# EAGLE design bmcontroller1 (EAGLE 9.3.1)
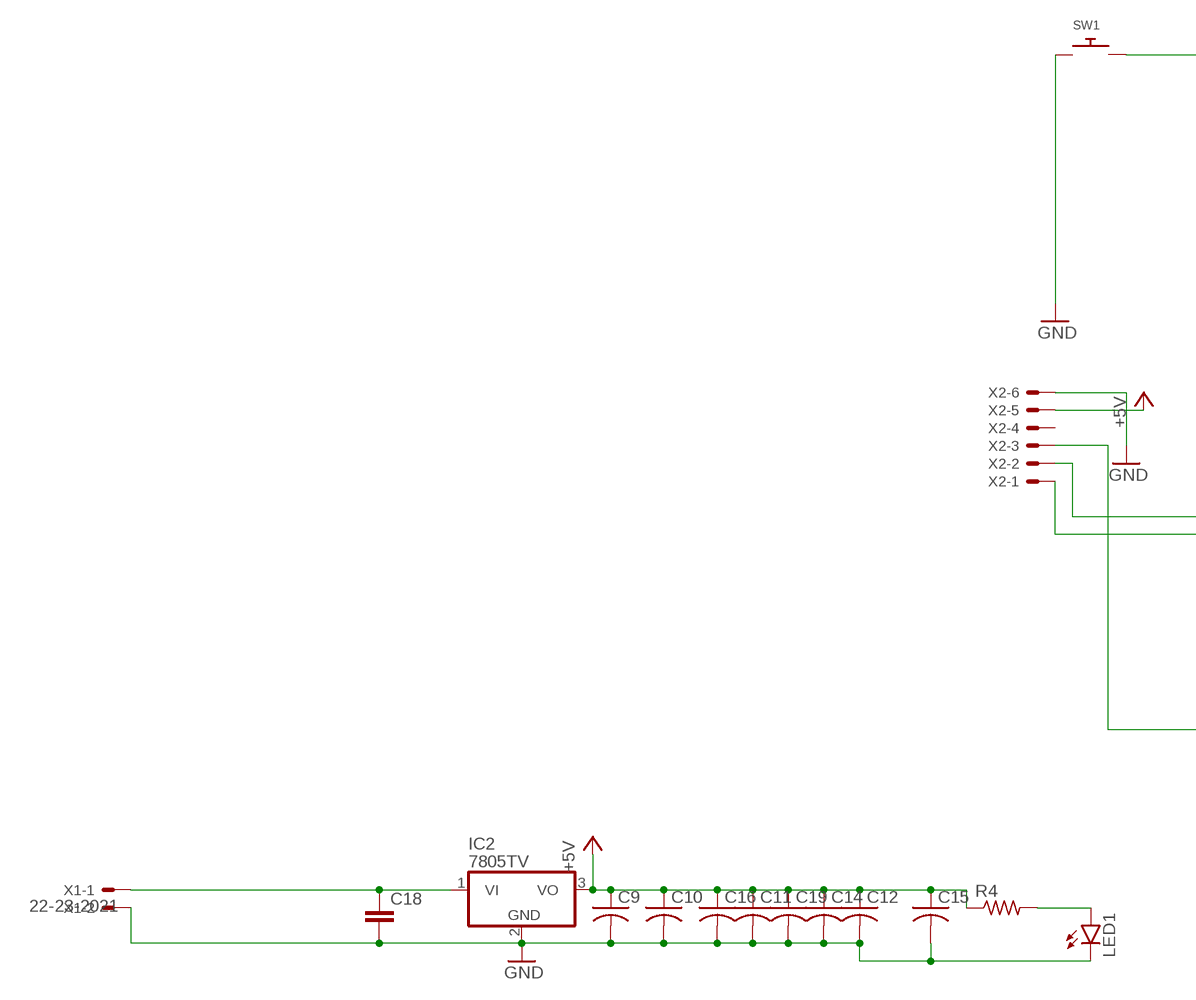
[diagram p0: schematic, sheet 1, part 1 of 2]
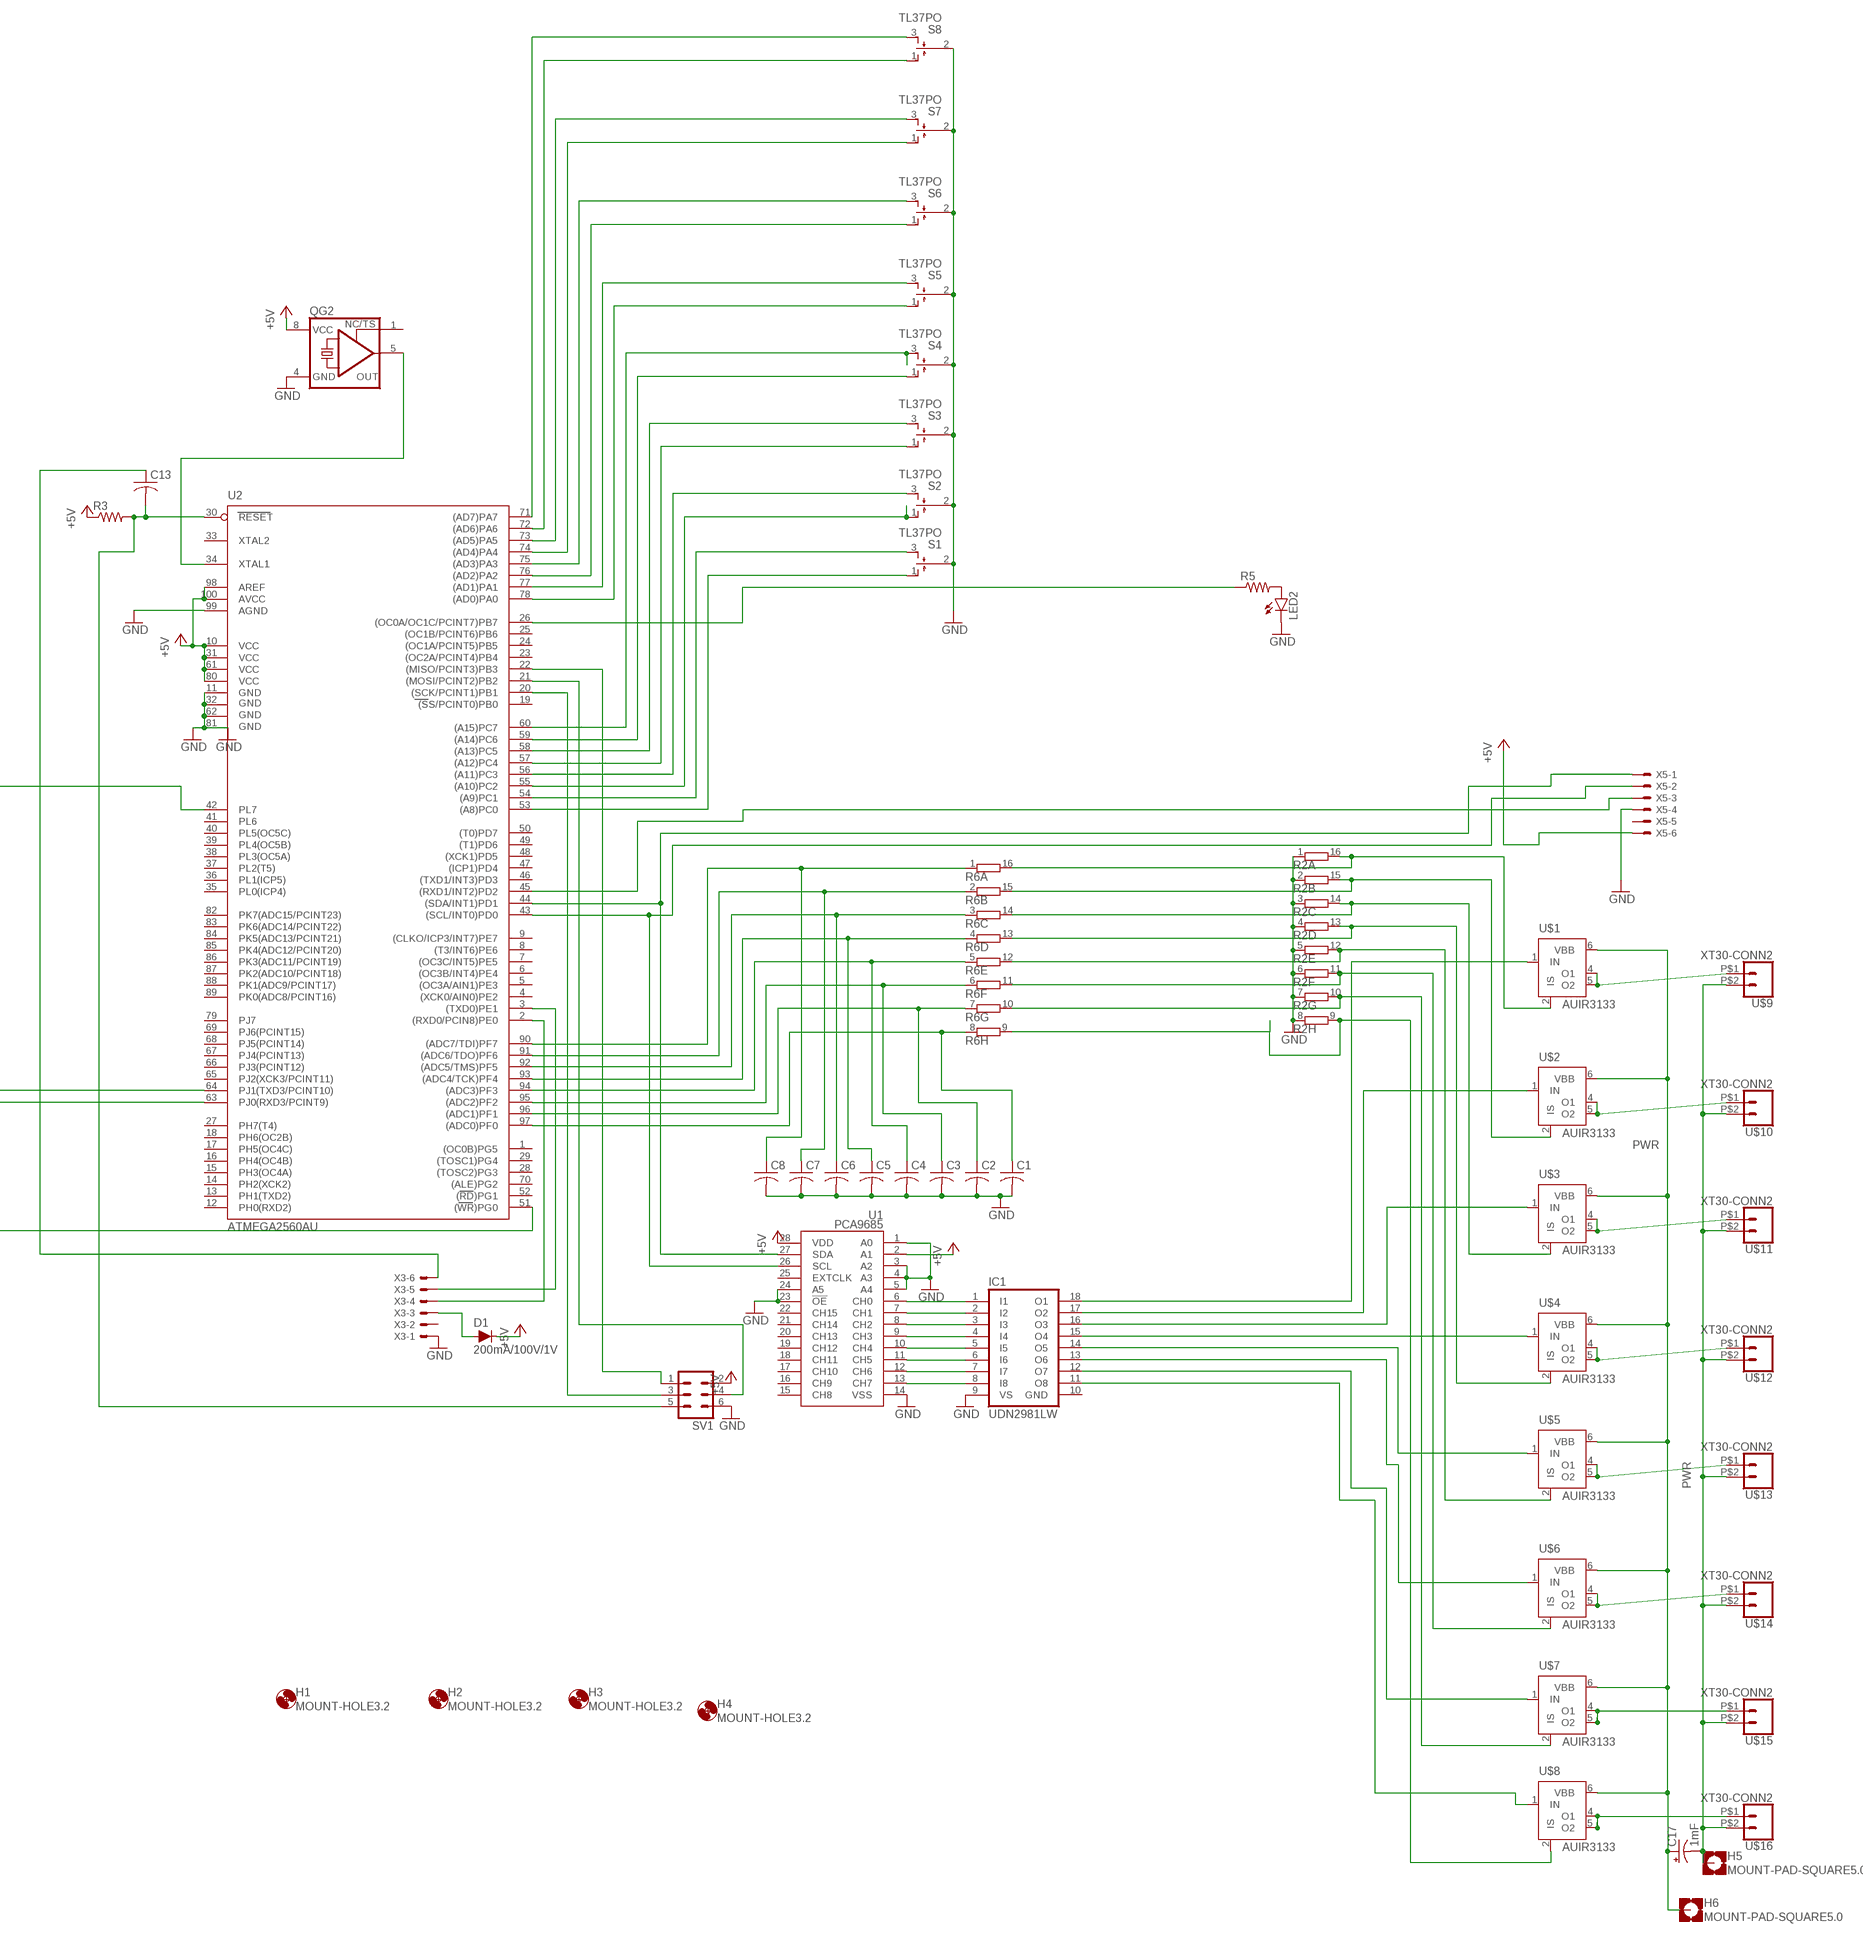
[diagram p1: schematic, sheet 1, part 2 of 2]

## Parts
C1  C-USC0805  [C0805]
C2  C-USC0805  [C0805]
C3  C-USC0805  [C0805]
C4  C-USC0805  [C0805]
C5  C-USC0805  [C0805]
C6  C-USC0805  [C0805]
C7  C-USC0805  [C0805]
C8  C-USC0805  [C0805]
C9  C-USC0805  [C0805]
C10  C-US025-024X044  [C025-024X044]
C11  C-US025-024X044  [C025-024X044]
C12  C-US025-024X044  [C025-024X044]
C13  C-US025-024X044  [C025-024X044]
C14  C-US025-024X044  [C025-024X044]
C15  C-US025-024X044  [C025-024X044]
C16  C-US025-024X044  [C025-024X044]
C17  1mF  1000UF-RADIAL-5MM-25V-20%  [CPOL-RADIAL-5MM-10MM]
C18  C2,5-3  [C2.5-3]
C19  C-USC0805  [C0805]
D1  200mA/100V/1V  DIODE-1N4148  [DIODE-1N4148]
H1  MOUNT-HOLE3.2  [3,2]
H2  MOUNT-HOLE3.2  [3,2]
H3  MOUNT-HOLE3.2  [3,2]
H4  MOUNT-HOLE3.2  [3,2]
H5  MOUNT-PAD-SQUARE5.0  [5,0-PAD-SQUARE]
H6  MOUNT-PAD-SQUARE5.0  [5,0-PAD-SQUARE]
IC1  UDN2981LW  [SO18W]
IC2  7805TV  [TO220V]
LED1  LED3MM  [LED3MM]
LED2  LED3MM  [LED3MM]
QG2  XO-8  [DIL08S]
R2  4816P-T01E  [4816P]
R3  R-US_R0805  [R0805]
R4  R-US_R0805  [R0805]
R5  R-US_R0805  [R0805]
R6  4816P-T01E  [4816P]
S1  TL37PO  [TL3XPO]
S2  TL37PO  [TL3XPO]
S3  TL37PO  [TL3XPO]
S4  TL37PO  [TL3XPO]
S5  TL37PO  [TL3XPO]
S6  TL37PO  [TL3XPO]
S7  TL37PO  [TL3XPO]
S8  TL37PO  [TL3XPO]
SV1  MA03-2  [MA03-2]
SW1  SWITCH_PUSHBUTTONEVQ-PE  [TACT_PANA-EVQ]
U1  PCA9685  [TSSOP-28_4MM]
U2  ATMEGA2560AU  [TQFP100]
U$1  AUIR3133  [TO263-51]
U$2  AUIR3133  [TO263-51]
U$3  AUIR3133  [TO263-51]
U$4  AUIR3133  [TO263-51]
U$5  AUIR3133  [TO263-51]
U$6  AUIR3133  [TO263-51]
U$7  AUIR3133  [TO263-51]
U$8  AUIR3133  [TO263-51]
U$9  XT30-CONN2  [XT30-2]
U$10  XT30-CONN2  [XT30-2]
U$11  XT30-CONN2  [XT30-2]
U$12  XT30-CONN2  [XT30-2]
U$13  XT30-CONN2  [XT30-2]
U$14  XT30-CONN2  [XT30-2]
U$15  XT30-CONN2  [XT30-2]
U$16  XT30-CONN2  [XT30-2]
X1  22-23-2021  [22-23-2021]
X2  22-23-2061  [22-23-2061]
X3  22-23-2061  [22-23-2061]
X5  22-23-2061  [22-23-2061]

## Nets
+5V [power]: C9.1 C10.1 C11.1 C12.1 C14.1 C15.1 C16.1 C19.1 D1.C IC2.3(VO) QG2.8(VCC) R3.1 R4.1 SV1.2 U1.2(A1) U1.28(VDD) U2.10(VCC) U2.31(VCC1) U2.61(VCC2) U2.80(VCC3) U2.98(AREF) U2.100(AVCC) X2.5 X5.6
BIGGND [vhp]: C17.- H5.B5(MOUNT) U$9.P$2 U$10.P$2 U$11.P$2 U$12.P$2 U$13.P$2 U$14.P$2 U$15.P$2 U$16.P$2
GND [power]: C1.2 C2.2 C3.2 C4.2 C5.2 C6.2 C7.2 C8.2 C9.2 C10.2 C11.2 C12.2 C14.2 C15.2 C16.2 C18.2 C19.2 IC1.9(VS) IC2.2(GND) LED1.K(C) LED2.K(C) QG2.4(GND) R2.1 R2.2 R2.3 R2.4 R2.5 R2.6 R2.7 R2.8 S1.2(P) S2.2(P) S3.2(P) S4.2(P) S5.2(P) S6.2(P) S7.2(P) S8.2(P) SV1.6 SW1.P$1 U1.1(A0) U1.3(A2) U1.4(A3) U1.5(A4) U1.14(VSS) U1.23(!OE) U1.24(A5) U2.11(GND) U2.32(GND1) U2.62(GND2) U2.81(GND3) U2.99(AGND) X1.2 X2.6 X3.1 X5.4
N$1: C8.1 R6.1 U2.90((ADC7/TDI)PF7)
N$2: C7.1 R6.2 U2.91((ADC6/TDO)PF6)
N$3: C6.1 R6.3 U2.92((ADC5/TMS)PF5)
N$4: C5.1 R6.4 U2.93((ADC4/TCK)PF4)
N$5: C4.1 R6.5 U2.94((ADC3)PF3)
N$6: C3.1 R6.6 U2.95((ADC2)PF2)
N$7: C2.1 R6.7 U2.96((ADC1)PF1)
N$8: C1.1 R6.8 U2.97((ADC0)PF0)
N$9: S8.1(O) U2.72((AD6)PA6)
N$10: IC1.18(O1) U$1.1(IN)
N$11: IC1.14(O5) U$5.1(IN)
N$12: IC1.1(I1) U1.6(CH0)
N$13: R2.13 R6.13 U$4.2(IS)
N$14: R2.12 R6.12 U$5.2(IS)
N$15: R2.11 R6.11 U$6.2(IS)
N$16: R2.10 R6.10 U$7.2(IS)
N$17: R5.1 U2.26((OC0A/OC1C/PCINT7)PB7)
N$18: R2.9 R6.9 U$8.2(IS)
N$19: IC1.2(I2) U1.7(CH1)
N$20: IC1.3(I3) U1.8(CH2)
N$21: IC1.4(I4) U1.9(CH3)
N$22: QG2.5(OUT) U2.34(XTAL1)
N$23: D1.A X3.3
N$24: S2.1(O) U2.55((A10)PC2)
N$25: C18.1 IC2.1(VI) X1.1
N$26: IC1.5(I5) U1.10(CH4)
N$36: S4.3(S) U2.60((A15)PC7)
N$39: S8.3(S) U2.71((AD7)PA7)
N$41: SW1.P$2 U2.42(PL7)
N$42: S7.3(S) U2.73((AD5)PA5)
N$43: S7.1(O) U2.74((AD4)PA4)
N$44: S6.3(S) U2.75((AD3)PA3)
N$45: S6.1(O) U2.76((AD2)PA2)
N$46: LED1.A R4.2
N$47: C13.2 R3.2 SV1.5 U2.30(RESET)
N$48: SV1.1 U2.22((MISO/PCINT3)PB3)
N$49: SV1.3 U2.20((SCK/PCINT1)PB1)
N$50: SV1.4 U2.21((MOSI/PCINT2)PB2)
N$51: C13.1 X3.6
N$52: U2.3((TXD0)PE1) X3.5
N$53: U2.2((RXD0/PCIN8)PE0) X3.4
N$54 [high power]: U$8.4(O1) U$8.5(O2) U$16.P$1
N$55: U1.27(SDA) U2.44((SDA/INT1)PD1) X5.1
N$56: U2.63(PJ0(RXD3/PCINT9)) X2.1
N$57: U2.64(PJ1(TXD3/PCINT10)) X2.2
N$58: U2.51((WR)PG0) X2.3
N$59: U1.26(SCL) U2.43((SCL/INT0)PD0) X5.2
N$60: U2.45((RXD1/INT2)PD2) X5.3
N$61 [high power]: U$7.4(O1) U$7.5(O2) U$15.P$1
N$62 [high power]: U$6.4(O1) U$6.5(O2) U$14.P$1
N$63 [high power]: U$5.4(O1) U$5.5(O2) U$13.P$1
N$64 [high power]: U$4.4(O1) U$4.5(O2) U$12.P$1
N$65 [high power]: U$3.4(O1) U$3.5(O2) U$11.P$1
N$66 [high power]: U$2.4(O1) U$2.5(O2) U$10.P$1
N$67 [high power]: U$1.4(O1) U$1.5(O2) U$9.P$1
N$68: IC1.6(I6) U1.11(CH5)
N$69: IC1.7(I7) U1.12(CH6)
N$70: IC1.16(O3) U$3.1(IN)
N$71: R2.14 R6.14 U$3.2(IS)
N$72: R2.15 R6.15 U$2.2(IS)
N$73: R2.16 R6.16 U$1.2(IS)
N$74: IC1.17(O2) U$2.1(IN)
N$75: IC1.8(I8) U1.13(CH7)
N$76: LED2.A R5.2
N$77: IC1.11(O8) U$8.1(IN)
N$78: IC1.12(O7) U$7.1(IN)
N$79: IC1.13(O6) U$6.1(IN)
N$80: IC1.15(O4) U$4.1(IN)
N$81: S5.3(S) U2.77((AD1)PA1)
N$82: S5.1(O) U2.78((AD0)PA0)
N$84: S4.1(O) U2.59((A14)PC6)
N$85: S3.3(S) U2.58((A13)PC5)
N$86: S3.1(O) U2.57((A12)PC4)
N$87: S2.3(S) U2.56((A11)PC3)
N$89: S1.3(S) U2.54((A9)PC1)
N$90: S1.1(O) U2.53((A8)PC0)
PWR [vhp]: C17.+ H6.B5(MOUNT) U$1.6(VBB) U$2.6(VBB) U$3.6(VBB) U$4.6(VBB) U$5.6(VBB) U$6.6(VBB) U$7.6(VBB) U$8.6(VBB)
Unconnected: QG2.1(TS) U1.15(CH8) U1.16(CH9) U1.17(CH10) U1.18(CH11) U1.19(CH12) U1.20(CH13) U1.21(CH14) U1.22(CH15) U1.25(EXTCLK) U2.1((OC0B)PG5) U2.4((XCK0/AIN0)PE2) U2.5((OC3A/AIN1)PE3) U2.6((OC3B/INT4)PE4) U2.7((OC3C/INT5)PE5) U2.8((T3/INT6)PE6) U2.9((CLKO/ICP3/INT7)PE7) U2.12(PH0(RXD2)) U2.13(PH1(TXD2)) U2.14(PH2(XCK2)) U2.15(PH3(OC4A)) U2.16(PH4(OC4B)) U2.17(PH5(OC4C)) U2.18(PH6(OC2B)) U2.19((SS/PCINT0)PB0) U2.23((OC2A/PCINT4)PB4) U2.24((OC1A/PCINT5)PB5) U2.25((OC1B/PCINT6)PB6) U2.27(PH7(T4)) U2.28((TOSC2)PG3) U2.29((TOSC1)PG4) U2.33(XTAL2) U2.35(PL0(ICP4)) U2.36(PL1(ICP5)) U2.37(PL2(T5)) U2.38(PL3(OC5A)) U2.39(PL4(OC5B)) U2.40(PL5(OC5C)) U2.41(PL6) U2.46((TXD1/INT3)PD3) U2.47((ICP1)PD4) U2.48((XCK1)PD5) U2.49((T1)PD6) U2.50((T0)PD7) U2.52((RD)PG1) U2.65(PJ2(XCK3/PCINT11)) U2.66(PJ3(PCINT12)) U2.67(PJ4(PCINT13)) U2.68(PJ5(PCINT14)) U2.69(PJ6(PCINT15)) U2.70((ALE)PG2) U2.79(PJ7) U2.82(PK7(ADC15/PCINT23)) U2.83(PK6(ADC14/PCINT22)) U2.84(PK5(ADC13/PCINT21)) U2.85(PK4(ADC12/PCINT20)) U2.86(PK3(ADC11/PCINT19)) U2.87(PK2(ADC10/PCINT18)) U2.88(PK1(ADC9/PCINT17)) U2.89(PK0(ADC8/PCINT16)) X2.4 X3.2 X5.5

## Power pins joined to a net without a drawn wire
GND: IC1.10(GND)

## Library data of the parts
C1-C8 C10-C16 = rcl:C-US: CAPACITOR, American symbol; SPICEPREFIX: C
C9 C19 = BeagleBone_Black_Wireless:C-US: CAPACITOR, American symbol
C17 = SparkFun-Capacitors:1000UF: 1,000µF/1mF ceramic capacitors A capacitor is a passive two-terminal electrical component used to store electrical energy temporarily in an electric field. CAP-08070; PROD_ID: CAP-09538
C18 = capacitor-wima:C: CAPACITOR naming: grid - package width
D1 = SparkFun-DiscreteSemi:DIODE: Diode These are standard reverse protection diodes and small signal diodes. SparkFun Products: SparkFun SparkPunk Sound Kit <https://www.sparkfun.com/products/11177> SparkFun ESP8266 Thing <https://www.sparkfun.com/products/13231>; PROD_ID: DIO-08378
H1-H4 = holes:MOUNT-HOLE: MOUNTING HOLE with drill center marker
H5 H6 = holes:MOUNT-PAD-SQUARE: MOUNTING PAD, square
IC1 = uln-udn:UDN298*: DRIVER ARRAY Source: Allegro Microsystems Inc. / UDN2981-UDN2984.pdf
IC2 = linear:78*: Positive VOLTAGE REGULATOR Source: http://cache.national.com/ds/LM/LM78L05.pdf http://www.fairchildsemi.com/ds/LM/LM7805.pdf
LED1 LED2 = led:LED: LED OSRAM: - CHIPLED LG R971, LG N971, LY N971, LG Q971, LY Q971, LO R971, LY R971 LH N974, LH R974 LS Q976, LO Q976, LY Q976 LO Q996 - Hyper CHIPLED LW Q18S LB Q993, LB Q99A, LB R99A - SideLED LS A670, LO A670, LY A670, LG A670, LP A670 LB A673, LV A673, LT A673, LW A673 LH A674 LY A675 LS A676, LA A676, LO A676, LY A676, LW A676 LS A679, LY A679, LG A679 - Hyper Micro SIDELED® LS Y876, LA Y876, LO Y876, LY Y876 LT Y87S - SmartLED LW L88C, LW L88S LB L89C, LB L89S, LG L890 LS L89K, LO L89K, LY L89K LS L896, LA L896, LO L896, LY L896 - TOPLED LS T670, LO T670, LY T670, LG T670, LP T670 LSG T670, LSP T670, LSY T670, LOP T670, LYG T670 LG T671, LOG T671, LSG T671 LB T673, LV T673, LT T673, LW T673 LH T674 LS T676, LA T676, LO T676, LY T676, LB T676, LH T676, LSB T676, LW T676 LB T67C, LV T67C, LT T67C, LS T67K, LO T67K, LY T67K, LW E67C LS E67B, LA E67B, LO E67B, LY E67B, LB E67C, LV E67C, LT E67C LW T67C LS T679, LY T679, LG T679 LS T770, LO T770, LY T770, LG T770, LP T770 LB T773, LV T773, LT T773, LW T773 LH T774 LS E675, LA E675, LY E675, LS T675 LS T776, LA T776, LO T776, LY T776, LB T776 LHGB T686 LT T68C, LB T68C - Hyper Mini TOPLED® LB M676 - Mini TOPLED Santana® LG M470 LS M47K, LO M47K, LY M47K Source: http://www.osram.convergy.de LUXEON: - LUMILED® LXK2-PW12-R00, LXK2-PW12-S00, LXK2-PW14-U00, LXK2-PW14-V00 LXK2-PM12-R00, LXK2-PM12-S00, LXK2-PM14-U00 LXK2-PE12-Q00, LXK2-PE12-R00, LXK2-PE12-S00, LXK2-PE14-T00, LXK2-PE14-U00 LXK2-PB12-K00, LXK2-PB12-L00, LXK2-PB12-M00, LXK2-PB14-N00, LXK2-PB14-P00, LXK2-PB14-Q00 LXK2-PR12-L00, LXK2-PR12-M00, LXK2-PR14-Q00, LXK2-PR14-R00 LXK2-PD12-Q00, LXK2-PD12-R00, LXK2-PD12-S00 LXK2-PH12-R00, LXK2-PH12-S00 LXK2-PL12-P00, LXK2-PL12-Q00, LXK2-PL12-R00 Source: www.luxeon.com KINGBRIGHT: KA-3528ASYC Source: www.kingbright.com
QG2 = crystal:XO-: CRYSTAL; OC_FARNELL: unknown; OC_NEWARK: unknown
R2 R6 = resistor-bourns:4816P-T01E: BOURNS RESISTOR NETWORK; OC_FARNELL: unknown; OC_NEWARK: unknown
R3-R5 = rcl:R-US_: RESISTOR, American symbol; SPICEPREFIX: R
S1-S8 = switch:TL37PO: TINY SWITCH MOM OFF MOM Source: http://www2.produktinfo.conrad.com/datenblaetter/700000-724999/705152-da-01-de-Subminiaturschalter_TL_36YO.pdf
SV1 = con-lstb:MA03-2: PIN HEADER; OC_FARNELL: unknown; OC_NEWARK: unknown
SW1 = adafruit:SWITCH_PUSHBUTTON: Buttons SOFTTOUCHSMD_SJ - Soft touch temporary push button (Super Junk Akihabara) Compatible with SKPMANE010 [Mouser: 688-SKPMAN] C&K_KSS = Digikey: KSS221GLFS
U1 = SparkFun-IC-Special-Function:PCA9685: 16-channel 12-bit PWM I2C interface Internal Oscillator 40Hz to 1kHz Can be totem pole or open collector 2.3V to 5.5V SparkFun Products SparkFun Block for Intel® Edison - PWM <https://www.sparkfun.com/products/13042> (DEV-13042) PROTO: IC-12240 PROD_ID: IC-12271; PROD_ID: IC-12271
U2 = SparkFun-IC-Microcontroller:ATMEGA2560: Atmel 100-pin 8-bit uC 64/128/256 Kbytes FLASH 4 Kbytes EEPROM 8 Kbytes SRAM 86 General Purpose I/O pins 12-channels16-bit PWM 4 x Serial USARTs 16-channels 10-bit A/D SparkFun Products None.; PROD_ID: IC-10040
U$1-U$8 = myc1:AUIR3133
U$9-U$16 = myc1:XT30-CONN2
X1 = con-molex:22-23-2021: .100" (2.54mm) Center Header - 2 Pin; MF: MOLEX; MPN: 22-23-2021; OC_FARNELL: 1462926; OC_NEWARK: 25C3832
X2 X3 X5 = con-molex:22-23-2061: .100" (2.54mm) Center Header - 6 Pin; MF: MOLEX; MPN: 22-23-2061; OC_FARNELL: 1462922; OC_NEWARK: 27C1933

## Net classes
1 power: width 0.305 mm, drill 0.254 mm, clearance 0.152 mm
2 high power: width 1.27 mm, drill 0.381 mm, clearance 0.152 mm
3 vhp: width 2.54 mm, drill 0.635 mm, clearance 0.152 mm

## Board
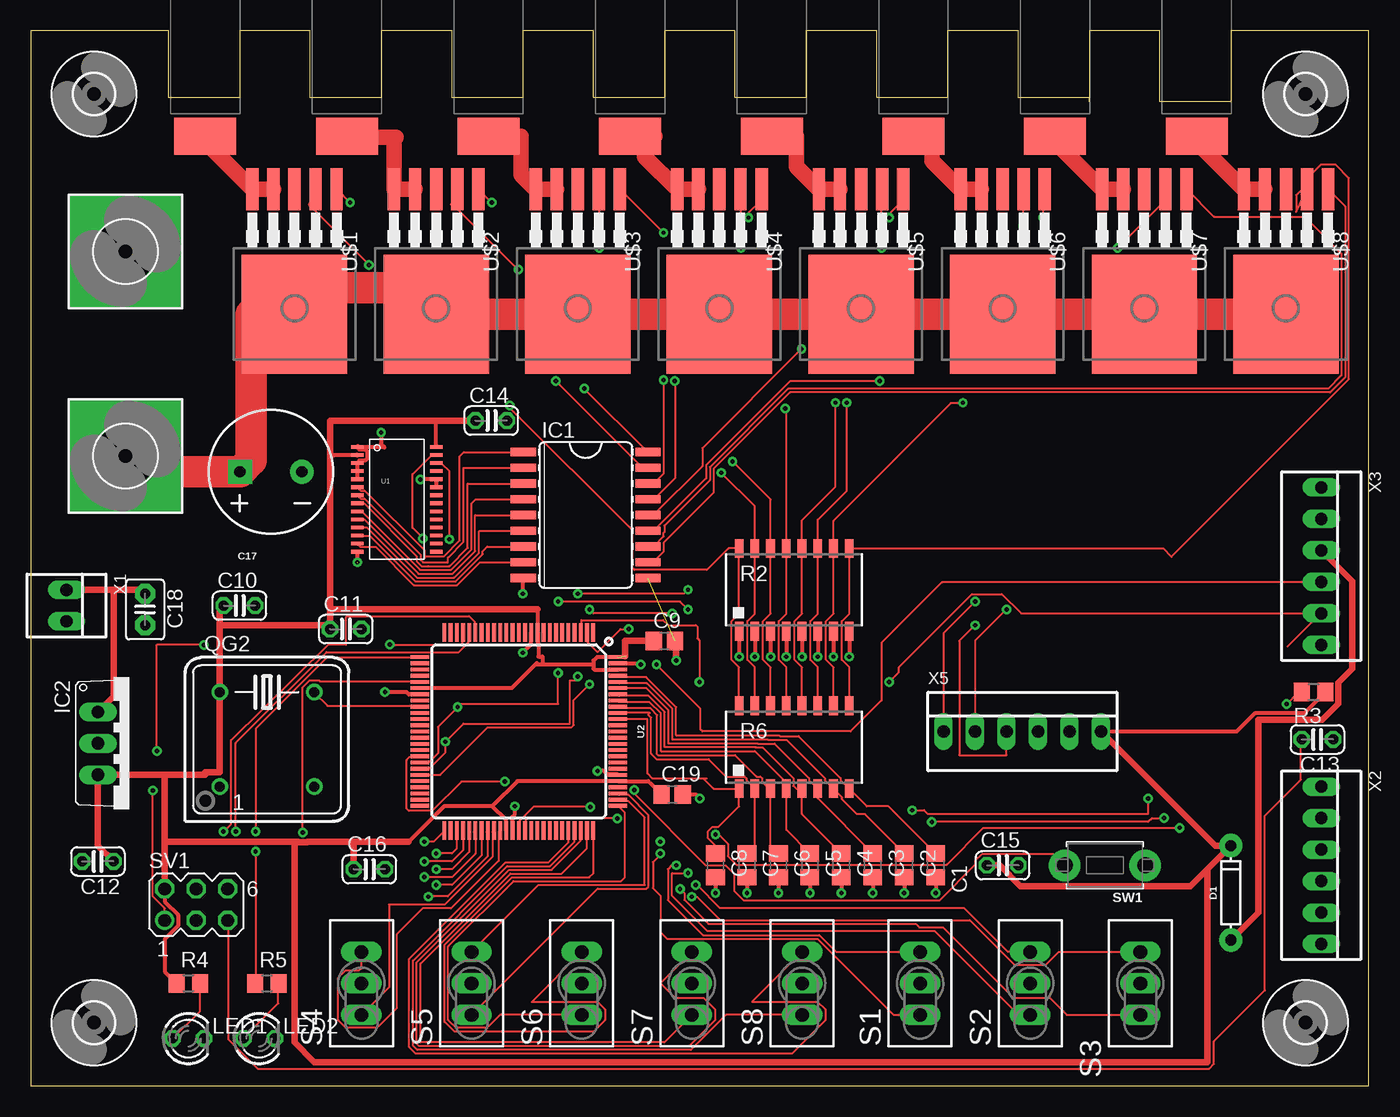
[diagram p2: board, top side]
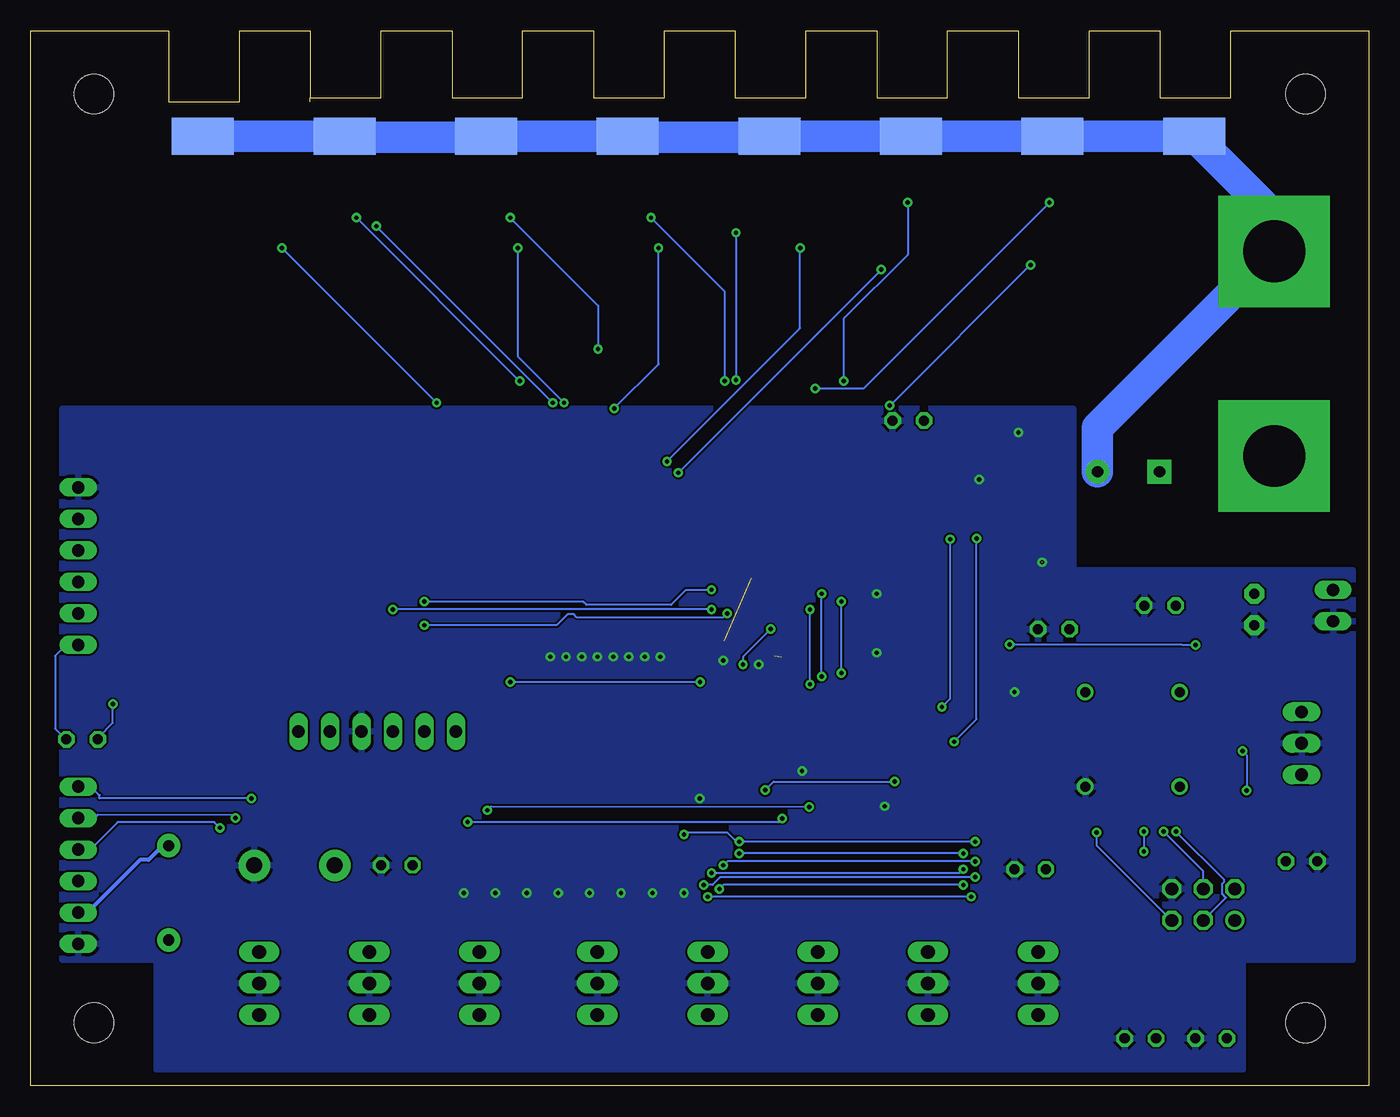
[diagram p3: board, bottom side, seen from below]

Size 107.95 x 85.09 mm. Coordinates in mm from the lower left corner, seen from the top.
Outline: 85.41,79.69 85.41,85.09 91.12,85.09 91.12,79.38 96.84,79.38 96.84,85.09 107.95,85.09 107.95,0 0,0 0,85.09 11.11,85.09 11.11,79.69 16.83,79.69 16.83,85.09 22.54,85.09 22.54,79.69 28.26,79.69 28.26,85.09 33.97,85.09 33.97,79.69 39.69,79.69 39.69,85.09 45.4,85.09 45.4,79.69 51.12,79.69 51.12,85.09 56.83,85.09 56.83,79.69 62.55,79.69 62.55,85.09 68.26,85.09 68.26,79.69 73.98,79.69 73.98,85.09 79.69,85.09 79.69,79.69 85.41,79.69
Outline: 85.41,79.38 85.41,79.69
Copper layers (1*16): Top 0.035mm / dielectric 1.5mm / Bottom 0.035mm
Design rules "default": minimum track width 6mil, minimum drill 0.35mm, track to track 6mil, track to pad 6mil, pad to pad 6mil, via to via 6mil, smd to smd 6mil, copper to edge 40mil, drill to drill 6mil, minimum pad ring 10mil, minimum via ring 8mil, stop-mask expansion 4mil, vias tented up to drill 0mil, thermal gap 10mil

### Footprints (pad centres in the part's own frame; a part is rotated, then mirrored left to right if it is on the bottom)
C0805 = smd 1.3 x 1.5: 1 -0.95,0; 2 0.95,0
C0805' = smd 1.3 x 1.5: 1 -0.85,0; 2 0.85,0
C025-024X044 = drill 0.813 octagon: 1 -1.27,0; 2 1.27,0
CPOL-RADIAL-5MM-10MM = drill 0.9 pad 1.93 square: + 2.5,0 | drill 0.9 pad 1.93: - -2.5,0
C2.5-3 = drill 0.813 pad 1.6 octagon: 1 -1.27,0; 2 1.27,0
DIODE-1N4148 = drill 0.9 pad 1.88: A -3.81,0; C 3.81,0
3,2 = hole 3.2: 0,0
5,0-PAD-SQUARE = drill 5 pad 9 square: B5 0,0
SO18W = smd 0.66 x 2.032: 1 -5.08,-5.029; 2 -3.81,-5.029; 3 -2.54,-5.029; 4 -1.27,-5.029; 5 0,-5.029; 6 1.27,-5.029; 7 2.54,-5.029; 8 3.81,-5.029; 9 5.08,-5.029; 10 5.08,5.029; 11 3.81,5.029; 12 2.54,5.029; 13 1.27,5.029; 14 0,5.029; 15 -1.27,5.029; 16 -2.54,5.029; 17 -3.81,5.029; 18 -5.08,5.029
TO220V = drill 1.016 long: 1 -2.54,-2.54; 2 0,-2.54; 3 2.54,-2.54
LED3MM = drill 0.813 octagon: A -1.27,0; K 1.27,0
DIL08S = drill 0.813: 1 -3.81,-3.81; 4 3.81,-3.81; 5 3.81,3.81; 8 -3.81,3.81
4816P = smd 0.7 x 1.5: 1 -4.445,-3.346; 2 -3.175,-3.346; 3 -1.905,-3.346; 4 -0.635,-3.346; 5 0.635,-3.346; 6 1.905,-3.346; 7 3.175,-3.346; 8 4.445,-3.346; 9 4.445,3.346; 10 3.175,3.346; 11 1.905,3.346; 12 0.635,3.346; 13 -0.635,3.346; 14 -1.905,3.346; 15 -3.175,3.346; 16 -4.445,3.346
R0805 = smd 1.3 x 1.5: 1 -0.95,0; 2 0.95,0
TL3XPO = drill 1.1 pad 1.422 long: 1 -2.54,0; 2 0,0; 3 2.54,0
MA03-2 = drill 1.016: 1 -2.54,-1.27 | drill 1.016 octagon: 2 -2.54,1.27; 3 0,-1.27; 4 0,1.27; 5 2.54,-1.27; 6 2.54,1.27
TACT_PANA-EVQ = drill 1.3 pad 2.54: P$1 -3.25,0; P$2 3.25,0
TSSOP-28_4MM = smd 1 x 0.3: 1 -3.2,4.225; 2 -3.2,3.575; 3 -3.2,2.925; 4 -3.2,2.275; 5 -3.2,1.625; 6 -3.2,0.975; 7 -3.2,0.325; 8 -3.2,-0.325; 9 -3.2,-0.975; 10 -3.2,-1.625; 11 -3.2,-2.275; 12 -3.2,-2.925; 13 -3.2,-3.575; 14 -3.2,-4.225; 15 3.2,-4.225; 16 3.2,-3.575; 17 3.2,-2.925; 18 3.2,-2.275; 19 3.2,-1.625; 20 3.2,-0.975; 21 3.2,-0.325; 22 3.2,0.325; 23 3.2,0.975; 24 3.2,1.625; 25 3.2,2.275; 26 3.2,2.925; 27 3.2,3.575; 28 3.2,4.225
TQFP100 = smd 1.5 x 0.3: 1 -8,6; 2 -8,5.5; 3 -8,5; 4 -8,4.5; 5 -8,4; 6 -8,3.5; 7 -8,3; 8 -8,2.5; 9 -8,2; 10 -8,1.5; 11 -8,1; 12 -8,0.5; 13 -8,0; 14 -8,-0.5; 15 -8,-1; 16 -8,-1.5; 17 -8,-2; 18 -8,-2.5; 19 -8,-3; 20 -8,-3.5; 21 -8,-4; 22 -8,-4.5; 23 -8,-5; 24 -8,-5.5; 25 -8,-6; 51 8,-6; 52 8,-5.5; 53 8,-5; 54 8,-4.5; 55 8,-4; 56 8,-3.5; 57 8,-3; 58 8,-2.5; 59 8,-2; 60 8,-1.5; 61 8,-1; 62 8,-0.5; 63 8,0; 64 8,0.5; 65 8,1; 66 8,1.5; 67 8,2; 68 8,2.5; 69 8,3; 70 8,3.5; 71 8,4; 72 8,4.5; 73 8,5; 74 8,5.5; 75 8,6 | smd 0.3 x 1.5: 26 -6,-8; 27 -5.5,-8; 28 -5,-8; 29 -4.5,-8; 30 -4,-8; 31 -3.5,-8; 32 -3,-8; 33 -2.5,-8; 34 -2,-8; 35 -1.5,-8; 36 -1,-8; 37 -0.5,-8; 38 0,-8; 39 0.5,-8; 40 1,-8; 41 1.5,-8; 42 2,-8; 43 2.5,-8; 44 3,-8; 45 3.5,-8; 46 4,-8; 47 4.5,-8; 48 5,-8; 49 5.5,-8; 50 6,-8; 76 6,8; 77 5.5,8; 78 5,8; 79 4.5,8; 80 4,8; 81 3.5,8; 82 3,8; 83 2.5,8; 84 2,8; 85 1.5,8; 86 1,8; 87 0.5,8; 88 0,8; 89 -0.5,8; 90 -1,8; 91 -1.5,8; 92 -2,8; 93 -2.5,8; 94 -3,8; 95 -3.5,8; 96 -4,8; 97 -4.5,8; 98 -5,8; 99 -5.5,8; 100 -6,8
TO263-51 = smd 1 x 3.4: 1 -3.4,-6.6; 2 -1.7,-6.6; 3 0,-6.6; 4 1.7,-6.6; 5 3.4,-6.6 | smd 8.5 x 9.6: 6 0,3.5
XT30-2 = smd 5 x 3: P$1 0.1,-12.3 | smd 5 x 3 bottom: P$2 0.1,-12.3
22-23-2021 = drill 1 long: 1 -1.27,0; 2 1.27,0
22-23-2061 = drill 1 long: 1 -6.35,0; 2 -3.81,0; 3 -1.27,0; 4 1.27,0; 5 3.81,0; 6 6.35,0

### Placement (x,y rotation side)
C1  73.03,17.78 270 top
C2  70.48,17.78 270 top
C3  67.94,17.78 270 top
C4  65.41,17.78 270 top
C5  62.87,17.78 270 top
C6  60.33,17.78 270 top
C7  57.78,17.78 270 top
C8  55.24,17.78 270 top
C9  [C0805']  51.12,35.88 0 top
C10  16.83,38.73 0 top
C11  25.4,36.83 0 top
C12  5.4,18.1 180 top
C13  103.82,27.94 180 top
C14  37.15,53.66 0 top
C15  78.42,17.78 0 top
C16  27.3,17.46 0 top
C17  19.37,49.53 180 top
C18  9.21,38.42 270 top
C19  [C0805']  51.75,23.5 0 top
D1  96.84,15.56 90 top
H1  102.87,80.01 0 top
H2  5.08,80.01 0 top
H3  102.87,5.08 0 top
H4  5.08,5.08 0 top
H5  7.62,67.31 0 top
H6  7.62,50.8 0 top
IC1  44.77,46.04 270 top
IC2  7.94,27.62 270 top
LED1  12.7,3.81 0 top
LED2  18.41,3.81 0 top
QG2  19.05,27.94 0 top
R2  61.59,40.01 0 top
R3  103.5,31.75 180 top
R4  12.7,8.26 0 top
R5  19.05,8.26 0 top
R6  61.59,27.3 0 top
S1  71.75,8.26 90 top
S2  80.64,8.26 90 top
S3  89.53,8.26 90 top
S4  26.67,8.26 90 top
S5  35.56,8.26 90 top
S6  44.45,8.26 90 top
S7  53.34,8.26 90 top
S8  62.23,8.26 90 top
SV1  13.34,14.61 0 top
SW1  86.68,17.78 180 top
U1  29.53,47.31 0 top
U2  39.37,28.57 270 top
U$1  21.27,65.72 180 top
U$2  32.7,65.72 180 top
U$3  44.13,65.72 180 top
U$4  55.56,65.72 180 top
U$5  66.99,65.72 180 top
U$6  78.42,65.72 180 top
U$7  89.85,65.72 180 top
U$8  101.28,65.72 180 top
U$9  13.97,88.9 0 top
U$10  25.4,88.9 0 top
U$11  36.83,88.9 0 top
U$12  48.26,88.9 0 top
U$13  59.69,88.9 0 top
U$14  71.12,88.9 0 top
U$15  82.55,88.9 0 top
U$16  93.98,88.9 0 top
X1  2.86,38.73 270 top
X2  104.14,17.78 270 top
X3  104.14,41.91 270 top
X5  80.01,28.57 0 top

### Tracks (layer width: path | path; a pad name or v marks a point on that pad's centre or on a via)
+5V  (1 unrouted)
  Top 0.305: 40.87,38.42 U2.10 40.91,36.53 40.91,35.7 40.96,35.66 40.96,34.61 41.27,34.61 41.27,33.97 | 40.83,34.11 40.69,33.97 | 40.69,33.97 38.79,32.08 U2.31 | U2.100 45.69,34.58 45.4,34.29 45.4,33.97 | 45.4,33.97 45.4,33.66 45.48,33.58 U2.98 | 45.4,33.97 41.27,33.97 | 41.27,33.97 40.69,33.97 | U2.61 38.33,20.62 38.33,21.45 37.23,22.54 | 37.23,22.54 33.34,22.54 30.48,19.68 26.04,19.68 21.27,19.68 | 37.23,22.54 39.27,24.57 U2.80 49.82,24.57 50.01,24.38 C19.1 | R3.1 102.79,30.09 98.83,30.09 97.32,28.57 X5.6 | R4.1 10.79,9.21 10.79,11.83 11.86,12.89 11.86,13.78 10.79,14.84 SV1.2 | 32.72,51.53 32.72,51.59 | 32.72,51.59 32.72,53.66 24.13,53.66 | 26.33,50.84 26.29,50.84 | 26.29,50.84 24.45,50.84 24.31,50.9 24.13,50.9 | 26.29,50.84 26.29,50.9 U1.2 | U1.28 32.77,51.59 32.72,51.59
  Top 0.508: 10.79,25.08 IC2.3 5.4,19.37 C12.1 | 10.79,25.08 14.07,25.08 14.07,25.3 15.24,25.3 QG2.8 15.24,37.15 | 15.24,37.15 15.24,38.73 C10.1 | 15.24,37.15 24.13,37.15 C11.1 24.13,38.42 | 24.13,38.42 24.13,50.9 24.13,53.66 C14.1 | SV1.2 10.79,19.68 | 10.79,19.68 10.79,25.08 | 10.79,19.68 21.27,19.68 | 40.87,38.42 24.13,38.42 | D1.C 95.57,19.37 X5.6 | D1.C 94.93,17.46 94.93,1.91 22.86,1.91 21.27,3.49 21.27,19.68 | C15.1 78.18,17.78 79.86,16.1 93.57,16.1 D1.C | C9.1 47.94,35.88 47.94,34.63 | C16.1 26.04,19.68 | 21.27,19.68 21.57,19.68 21.62,19.64 22.27,19.64 22.32,19.68 30.48,19.68
  Bottom 0.305: X2.5 104.09,14.02 103.33,14.02 99.14,18.21 98.45,18.21 97.31,19.36 96.85,19.36 D1.C
BIGGND
  Bottom 0.076: 16.51,76.83 15.77,76.83 14.92,76.83 | 25.5,76.83 U$10.P$2
  Bottom 2.54: U$9.P$2 7.62,70.15 H5.B5 7.92,66.06 8.39,66.53 | U$9.P$2 U$10.P$2 U$11.P$2 U$12.P$2 48.36,76.52 58.52,76.52 | 58.52,76.52 60.96,76.52 | U$14.P$2 U$13.P$2 58.52,76.5 58.52,76.52 | 71.75,76.52 71.75,76.6 U$14.P$2 | U$14.P$2 71.22,76.52 82.65,76.52 | 83.5,76.52 82.65,76.52 | 82.65,76.52 U$15.P$2 U$16.P$2 | 15.77,76.83 15.77,76.81 U$9.P$2 | C17.- 21.87,53.06 8.39,66.53 | 8.39,66.53 8.26,66.67
GND  (via drill 0.35)  (2 unrouted)
  Top 0.305: U2.62 38.87,21.73 39.05,21.91 v39.05,22.54 | U2.81 47.33,25.12 46.49,25.12 46.21,25.4 v45.72,25.4 | U2.99 49.11,34.08 v49.21,33.97 | U2.32 30.48,31.57 30.3,31.75 v28.57,31.75 | C8.2 v55.24,15.56 | C7.2 v57.78,15.56 | C6.2 v60.33,15.56 | C5.2 v62.87,15.56 | C4.2 v65.41,15.56 | C3.2 v67.94,15.56 | C2.2 v70.48,15.56 | C1.2 v73.03,15.56 | U1.5 U1.4 U1.3 26.52,50.43 26.95,50.43 27.13,50.61 27.13,51.16 26.95,51.34 26.52,51.34 U1.1 26.36,51.59 26.36,51.5 | v28.26,52.7 28.26,51.75 28.53,51.49 26.36,51.5 | 26.36,51.5 26.34,51.5 | U1.23 U1.24 32.61,48.92 32.61,48.91 | 32.73,48.91 32.61,48.91 | 32.61,48.91 31.47,48.91 | 31.47,48.91 31.43,48.91 | U1.14 26.34,43.05 | 26.34,43.05 v26.34,42.23 26.44,42.14 | U2.11 40.33,36.53 40.33,35.7 40.32,35.7 40.32,35.56 v39.69,34.92 | 31.47,48.91 31.47,48.92 v31.43,48.9 | 26.34,43.05 26.36,43.05 U1.14 | C19.2 53.66,23.5 v53.98,23.18 | IC1.9 39.69,40.91 v39.69,39.69 | R2.1 v57.15,34.61 | R2.2 v58.42,34.61 | R2.3 v59.69,34.61 | R2.4 v60.96,34.61 | R2.5 v62.23,34.61 | R2.6 v63.5,34.61 | R2.7 v64.77,34.61 | R2.8 v66.04,34.61
  Top 0.508: C9.2 52.07,35.77 v52.07,34.29
  pour Bottom: 1.27,41.59 1.27,10.16 10.16,10.16 10.16,1.27 97.79,1.27 97.79,10.16 105.41,10.16 105.41,54.61 23.81,54.61 23.81,41.59
N$1
  Top 0.152: C8.1 55.24,19.37 54.61,20 54.64,20.03 54.64,20.52 54.99,20.88 55.48,20.88 57.15,22.54 R6.1 55.1,23.96 54.29,24.77 | U2.90 49.74,29.57 49.74,25.19 50.16,24.77 54.29,24.77 | 54.55,24.77 54.29,24.77
N$2
  Top 0.152: 49.94,30.07 49.85,30.07 | 49.85,30.07 U2.91 | 49.85,30.07 49.85,29.9 50.05,29.7 50.05,26.79 50.48,26.35 54.69,26.35 56.1,24.94 57.59,24.94 57.73,24.8 57.73,24.65 R6.2 58.42,19.36 C7.1
N$3
  Top 0.152: U2.92 47.49,30.45 49.99,30.45 50.54,29.9 50.54,26.73 50.6,26.67 56.83,26.67 58.56,24.94 58.87,24.94 59,24.8 59,24.5 59.54,23.96 R6.3 59.69,19.36 C6.1
N$4
  Top 0.152: U2.93 47.49,30.95 49.92,30.95 50.84,30.03 50.84,26.99 58.42,26.99 60.96,24.45 R6.4 60.96,20.64 C5.1
N$5
  Top 0.152: 63.81,20.32 C4.1 62.23,21.91 R6.5 61.77,23.96 61.54,24.19 61.54,24.8 59.05,27.29 58.43,27.29 58.42,27.3 | 58.53,27.3 58.42,27.3 | 58.42,27.3 51.15,27.3 51.15,30.15 49.85,31.45 47.49,31.45 U2.94
N$6
  Top 0.152: 47.36,32.07 49.67,32.07 51.45,30.28 51.45,27.62 58.65,27.62 58.67,27.6 60.02,27.6 62.81,24.8 62.81,24.65 R6.6 63.5,23.18 C3.1 | 46.67,32.07 47.36,32.07 | 47.36,32.07 U2.95
N$7
  Top 0.152: C2.1 67.31,21.91 66.67,21.91 65.46,23.11 65.46,23.27 R6.7 64.08,24.65 64.08,24.8 60.98,27.9 59.49,27.9 59.45,27.94 51.76,27.94 51.76,30.41 49.71,32.45 47.49,32.45 U2.96
N$8
  Top 0.152: C1.1 69.21,22.54 67.46,22.54 R6.8 65.35,24.65 65.35,24.8 61.95,28.21 60.45,28.21 60.4,28.26 52.07,28.26 52.06,28.26 52.06,30.53 49.64,32.95 47.37,32.95 47.37,32.96 U2.97
N$9
  Top 0.152: U2.72 43.87,19.7 41.89,17.72 38.44,17.72 30.82,10.1 30.82,3.24 31.18,2.88 53.25,2.88 56.09,5.71 S8.1
N$10  (via drill 0.35)
  Top 0.152: v44.65,56.24 49.76,51.13 IC1.18 | v25.76,71.25 24.69,72.31 U$1.1
  Bottom 0.152: v44.65,56.24 40.77,56.24 v25.76,71.25
N$11  (via drill 0.35)
  Top 0.152: 50.23,46.06 49.85,46.06 49.82,46.04 | 49.82,46.04 49.81,46.03 | 49.82,46.04 49.84,46.02 IC1.14 50.29,46.1 54.18,49.99 54.18,51.44 v62.18,59.44 | v69.27,70.03 69.27,70.33 70.33,71.4 70.33,72.31 U$5.1
  Bottom 0.152: v62.18,59.44 62.18,62.94 v69.27,70.03
N$12
  Top 0.152: U1.6 26.6,48.01 26.92,48.01 31.75,43.18 31.75,42.55 31.91,42.7 33.32,42.7 34.61,43.99 34.61,50.8 34.92,51.12 IC1.1
N$13  (via drill 0.35)
  Top 0.152: v57.3,67.59 57.3,72.31 U$4.2 | R6.13 60.96,33.75 60.35,34.36 60.35,37.48 60.96,38.08 R2.13 60.96,54.56 v60.88,54.63
  Bottom 0.152: v57.3,67.59 57.3,58.22 v60.88,54.63
N$14  (via drill 0.35)
  Top 0.152: v68.66,67.59 68.66,72.31 U$5.2 | v64.92,55.09 64.92,48.31 62.23,45.62 R2.12 62.23,38.08 61.62,37.48 61.62,34.36 62.23,33.75 R6.12
  Bottom 0.152: v68.66,67.59 68.66,58.83 v64.92,55.09
N$15  (via drill 0.35)
  Top 0.152: v80.09,69.34 80.09,72.31 U$6.2 | v65.84,55.09 65.84,48.01 63.5,45.67 R2.11 63.5,38.08 62.89,37.48 62.89,34.36 63.5,33.75 R6.11
  Bottom 0.152: v65.84,55.09 v80.09,69.34
N$16  (via drill 0.35)
  Top 0.152: v87.71,67.59 91.52,71.4 91.52,72.31 U$7.2 | 74.22,55.09 74.3,55.09 | 74.3,55.09 v75.21,55.09 | R6.10 64.77,33.75 64.16,34.36 64.16,37.48 64.77,38.08 R2.10 64.77,45.57 74.3,55.09
  Bottom 0.152: v75.21,55.09 v87.71,67.59
N$17  (via drill 0.35)
  Top 0.152: v18.14,18.9 18.14,8.31 R5.1 | v18.14,20.5 18.14,28.8 23.85,34.52 31.32,34.52 U2.26
  Bottom 0.152: v18.14,20.5 v18.14,18.9
N$18
  Top 0.152: 102.79,72.54 102.11,71.86 102.11,70.49 U$8.2 102.79,72.54 | 102.79,72.54 102.79,73 104.09,74.3 105.31,74.3 106.38,73.23 106.38,57 92.05,42.67 91.37,43.35 R2.9 66.04,38.08 65.43,37.48 65.43,34.36 66.04,33.75 R6.9
N$19
  Top 0.152: U1.7 26.6,47.36 26.92,47.36 31.45,42.84 31.45,42.42 31.64,42.23 33.66,42.23 33.66,42.61 34.91,43.86 34.91,49.84 34.92,49.85 IC1.2
N$20
  Top 0.152: U1.8 26.87,46.98 31.14,42.71 31.14,42.29 31.51,41.92 32.05,41.92 32.07,41.91 32.08,41.92 33.78,41.92 35.24,43.38 35.24,48.58 IC1.3
N$21
  Top 0.152: U1.9 26.36,46.33 | 26.36,46.33 26.67,46.33 31.4,41.6 33.9,41.6 35.55,43.26 35.55,46.98 35.88,47.31 IC1.4 | U1.9 | 26.3,46.37 26.31,46.35 | 26.31,46.35 U1.9 | 26.31,46.35 26.36,46.41 U1.9 | U1.9 26.36,46.33
N$22
  Top 0.152: U2.34 31.32,30.63 23.93,30.63 22.86,31.7 QG2.5
N$23
  Top 0.508: D1.A 99.06,13.97 99.06,29.53 104.21,29.53 105.51,30.83 105.51,32.52 106.64,33.66 106.64,40.68 X3.3
N$24  (via drill 0.35)
  Top 0.152: U2.55 35.37,18.86 33.97,17.46 v32.7,17.46 | S2.1 79.69,5.71 72.95,12.46 54.61,12.46 51.75,15.32 51.75,17.14 v53.02,17.14
  Bottom 0.152: v32.7,17.46 33.02,17.14 v53.02,17.14
N$25
  Top 0.508: X1.1 6.67,40.01 | 6.67,40.01 8.89,40.01 C18.1 | 6.67,40.01 6.67,31.43 IC2.1
N$26
  Top 0.152: U1.10 26.89,45.68 31.27,41.3 34.02,41.3 35.85,43.13 35.85,46.01 35.88,46.04 IC1.5
N$36
  Top 0.152: U2.60 37.75,20.45 37.75,18.14 33.91,14.3 31.59,14.3 29.53,12.23 29.53,6.26 27.93,4.66 25.41,4.66 24.79,5.28 24.79,8.69 25.41,9.31 26.45,9.31 26.67,9.53 S4.3
N$39
  Top 0.152: U2.71 43.37,19.63 41.76,18.02 38.32,18.02 30.52,10.22 30.52,3.11 31.05,2.58 61.41,2.58 64.11,5.28 64.11,6.15 63.49,6.77 58.2,6.77 S8.3
N$41  (via drill 0.35)
  Top 0.152: v38.25,24.54 34.75,24.54 32.38,22.17 30.48,22.17 30.33,22.33 30.33,26.29 30.56,26.52 31.32,26.52 U2.42 | v48.69,23.85 48.69,23.55 54.48,17.75 56.08,17.75 56.77,17.07 56.77,15.7 57.53,14.94 73.3,14.94 76.2,17.83 76.2,18.14 76.73,18.67 82.53,18.67 83.36,17.83 SW1.P$2
  Bottom 0.152: v38.25,24.54 48.01,24.54 v48.69,23.85
N$42
  Top 0.152: U2.73 44.37,19.77 42.02,17.41 38.57,17.41 31.13,9.97 31.13,3.37 31.31,3.19 53.13,3.19 55.22,5.28 55.22,6.15 54.3,7.07 51.99,7.07 50.8,8.26 S7.3
N$43
  Top 0.152: S7.1 51.12,3.49 31.43,3.49 31.43,9.85 38.7,17.11 42.82,17.11 44.87,19.15 U2.74
N$44
  Top 0.152: S6.3 40.42,6.77 45.71,6.77 46.33,6.15 46.33,5.28 45.41,4.36 34.17,4.36 33.38,5.15 33.38,11.36 38.82,16.8 45.06,16.8 45.4,17.14 45.4,20.54 U2.75
N$45
  Top 0.152: S6.1 37.88,5.71 36.82,4.66 34.3,4.66 33.68,5.28 33.68,11.23 38.95,16.5 47.61,16.5 47.94,16.83 47.94,22 U2.76
N$46
  Top 0.152: LED1.A 13.64,6.02 13.64,8.23 R4.2
N$47  (via drill 0.35)
  Top 0.152: v101.35,30.79 102.26,31.7 102.49,31.7 R3.2 | v21.95,20.42 21.95,32.16 22.48,32.69 23.24,32.69 23.32,32.61 31.32,32.61 U2.30 | C13.2 102.49,27.89 102.49,24.69 99.59,21.79 99.59,7.7 95.48,3.58 95.48,1.75 95.1,1.37 18.29,1.37 15.93,3.73 15.93,13.34 SV1.5
  Bottom 0.152: v101.35,30.79 101.35,29.26 102.49,28.12 102.49,27.96 C13.2 | v21.95,20.42 21.95,19.36 15.93,13.34 SV1.5
N$48  (via drill 0.35)
  Top 0.152: v28.96,35.59 34.67,35.59 34.82,35.74 34.82,36.5 U2.22 | SV1.1 10.79,14.3 9.8,15.29 9.8,16.29 9.84,16.32 v9.84,23.81 | v10.16,26.99 10.16,35.56 v13.97,35.56
  Bottom 0.152: 10.74,13.56 10.74,13.34 SV1.1 | v10.16,26.99 9.84,26.67 v9.84,23.81 | v28.96,35.59 15.08,35.59 v13.97,35.56
N$49  (via drill 0.35)
  Top 0.152: v15.54,20.5 16.15,21.11 16.15,27.88 23.98,35.56 25.4,35.56 25.4,37.78 25.5,37.88 35.34,37.88 35.81,37.41 35.81,36.58 U2.20
  Bottom 0.152: v15.54,20.5 11.66,16.61 11.66,16.46 11.81,16.31 11.81,15.47 11.51,15.16 SV1.3
N$50  (via drill 0.35)
  Top 0.152: v16.54,20.5 16.54,27.66 23.85,34.98 34.52,34.98 35.36,35.81 35.36,36.5 U2.21
  Bottom 0.152: v16.54,20.5 13.34,17.3 SV1.4
N$51
  Bottom 0.152: C13.1 105.16,27.96 105.99,28.8 105.99,34.67 105.16,35.51 104.17,35.51 X3.6
N$52  (via drill 0.35)
  Top 0.152: 101.42,35.43 104.09,38.1 X3.5 79.92,38.1 78.36,39.66 75.95,39.66 70.02,33.73 70.02,33.33 v69.27,32.58 | U2.3 44.42,36.58 44.42,37.57 51.02,37.57 51.44,37.15 53.66,37.15 53.78,37.03 53.78,36.08 53.95,35.91 v53.95,32.58
  Bottom 0.152: v69.27,32.58 v53.95,32.58
N$53  (via drill 0.35)
  Top 0.152: U2.2 44.88,36.5 44.88,35.81 45.72,34.98 47.57,36.83 v48.26,36.83 | X3.4 104.09,40.62 73.53,40.62 68.66,35.74 68.66,31.08 66.15,28.57 54.18,28.57 54.03,28.73 54.03,30.43 v50.48,33.97
  Bottom 0.152: v48.26,36.83 50.48,34.61 v50.48,33.97
N$54
  Top 1.27: U$16.P$1 94.08,76.06 94.15,76.06 U$8.5 U$8.4
N$55  (via drill 0.35)
  Top 0.152: 32.7,50.86 32.32,50.86 30.8,49.34 30.8,45 v31.64,44.16 | 32.7,50.86 U1.27 | U2.44 31.39,25.6 32.16,25.6 33.45,26.9 v33.45,27.75 34.91,29.21 43.5,29.21 43.5,32.7 44.13,32.7 v44.13,33.02 | v76.2,39.05 73.66,36.51 X5.1 | v53.02,40.01 52.7,39.69 v44.13,39.69 | U1.27 32.77,50.9 32.7,50.86
  Bottom 0.152: v31.64,44.16 31.64,29.57 v33.45,27.75 | v44.13,33.02 v44.13,39.69 | v76.2,39.05 63.38,39.05 63.12,38.79 56.29,38.79 55.07,40.01 v53.02,40.01
N$56  (via drill 0.35)
  Top 0.152: v45.15,22.49 40.55,22.49 39.4,21.34 39.4,20.65 U2.63 | v71.12,22.23 72.07,22.23 72.39,21.91 90.17,21.91 v90.17,23.18
  Bottom 0.152: X2.1 104.09,24.08 103.1,24.08 102.49,23.47 102.41,23.47 102.39,23.44 102.43,23.18 v90.17,23.18 | v71.12,22.23 70.8,22.54 v45.15,22.49
N$57  (via drill 0.35)
  Top 0.152: v47.32,21.57 40.08,21.57 39.93,21.41 39.93,20.65 U2.64 | v91.44,21.59 90.49,21.59 90.17,21.27 v72.71,21.27
  Bottom 0.152: X2.2 104.09,21.64 102.79,21.64 102.56,21.87 91.44,21.9 v91.44,21.59 | v47.32,21.57 47.64,21.25 72.68,21.25 v72.71,21.27
N$58  (via drill 0.35)
  Top 0.152: U2.51 32.48,19.68 v31.75,19.68 | v92.7,20.8 76.89,20.8 73.91,17.83 56.92,17.83 56.24,18.52 56.24,19.51 55.47,20.27 v55.24,20.27
  Bottom 0.152: v31.75,19.68 v50.8,19.68 50.83,19.74 51.05,19.74 51.74,20.42 55.09,20.42 v55.24,20.27 | X2.3 103.17,19.05 100.97,21.26 93.15,21.26 v92.7,20.8
N$59  (via drill 0.35)
  Top 0.152: v33.77,44.08 33.77,49.57 33.16,50.18 32.78,50.18 U1.26 32.77,50.29 U1.26 | U2.43 31.39,26.14 32.16,26.14 32.84,26.82 32.84,28.96 v34.43,30.54 34.34,30.63 34.51,30.8 42.55,30.8 v42.55,33.29 | 75.87,28.57 X5.2 76.2,35.88 v78.74,38.42 | v53.02,38.42 52.39,39.05 v42.55,39.05
  Bottom 0.152: v33.77,44.08 33.77,31.2 v34.43,30.54 | v42.55,33.29 v42.55,39.05 | v53.02,38.42 v78.74,38.42
N$60  (via drill 0.35)
  Top 0.152: 31.39,25.15 U2.45 33.02,25.08 36.84,28.91 43.62,28.91 43.8,29.08 43.8,31.1 v45.09,32.38 | 78.69,28.57 X5.3 78.74,26.67 74.93,26.67 74.93,35.88 v76.2,37.15 | v51.75,38.1 45.4,38.1 v45.09,38.42
  Bottom 0.152: v45.09,32.38 v45.09,38.42 | v76.2,37.15 65.51,37.15 64.64,38.02 64.14,38.02 63.93,37.81 52.04,37.81 v51.75,38.1
N$61
  Top 1.27: 83.78,76.2 83.19,76.2 82.68,76.58 | 82.68,76.58 U$15.P$1 | U$7.4 U$7.5 82.68,76.1 82.68,76.58
N$62
  Top 1.27: 72.03,77.15 71.44,77.15 71.25,76.66 71.25,76.63 U$14.P$1 72.24,76.58 72.71,76.52 72.71,74.64 U$6.5 U$6.4
N$63
  Top 1.27: U$5.4 U$5.5 61.78,74.13 61.78,76.6 U$13.P$1
N$64
  Top 1.27: U$4.4 U$4.5 49.53,74.95 49.53,76.6 | 50.35,76.6 49.53,76.6 | 49.53,76.6 U$12.P$1
N$65
  Top 1.27: U$3.4 U$3.5 39.56,73.5 39.56,76.6 U$11.P$1
N$66
  Top 1.27: U$10.P$1 25.53,76.66 26.04,76.52 29.48,76.52 29.3,76.34 U$2.5 U$2.4
N$67
  Top 1.27: 14.29,76.52 13.65,76.52 | 14.29,76.52 14.1,76.58 U$9.P$1 | U$1.4 U$1.5 14.29,75.91 14.29,76.52
N$68
  Top 0.152: U1.11 27.11,45.03 31.14,41 34.15,41 36.16,43.01 36.16,44.73 36.2,44.77 IC1.6
N$69
  Top 0.152: U1.12 27.33,44.38 31.02,40.69 34.27,40.69 36.46,42.88 36.46,43.13 36.83,43.5 IC1.7
N$70  (via drill 0.35)
  Top 0.152: 50.23,48.58 IC1.16 50.29,48.62 51.05,49.38 v51.05,56.92 | v51.05,68.81 47.55,72.31 U$3.1
  Bottom 0.152: v51.05,68.81 v51.05,56.92
N$71  (via drill 0.35)
  Top 0.152: v45.87,67.59 45.87,72.31 U$3.2 | R6.14 59.69,33.75 59.08,34.36 59.08,37.48 59.69,38.08 R2.14 59.69,47.3 v56.62,50.37
  Bottom 0.152: v45.87,67.59 45.87,61.11 v56.62,50.37
N$72  (via drill 0.35)
  Top 0.152: 33.9,71.08 U$2.2 33.98,71.17 v39.32,65.84 | R6.15 58.42,33.75 57.81,34.36 57.81,37.48 58.42,38.08 R2.15 58.42,46.74 v55.7,49.45
  Bottom 0.152: v55.7,49.45 v39.32,65.84
N$73  (via drill 0.35)
  Top 0.152: 22.44,71.08 U$1.2 22.48,71.02 v27.28,66.22 | v38.63,54.86 38.63,54.71 48.54,44.81 48.54,41.76 48.69,41.6 54.56,41.6 56.3,43.35 R2.16 57.15,38.08 56.54,37.48 56.54,34.36 57.15,33.75 R6.16
  Bottom 0.152: v38.63,54.86 v27.28,66.22
N$74  (via drill 0.35)
  Top 0.152: 50.23,49.87 49.85,49.87 49.82,49.85 | 49.82,49.85 49.81,49.84 | 49.82,49.85 49.84,49.84 IC1.17 49.76,49.91 49.3,49.91 v42.37,56.84 | v37.19,71.25 36.12,72.31 U$2.1
  Bottom 0.152: v42.37,56.84 42.37,61.87 37.19,67.06 v37.19,71.25
N$75
  Top 0.152: U1.13 26.6,43.46 27.82,43.46 30.89,40.39 34.4,40.39 36.24,42.23 IC1.8
N$76
  Top 0.152: LED2.A 19.96,6.63 19.96,8.23 R5.2
N$77
  Top 0.152: 49.82,42.23 49.85,42.25 50.23,42.25 51.05,43.08 51.05,43.81 55.09,47.85 55.09,49.76 61.27,55.93 104.85,55.93 106.07,57.15 106.07,70.94 104.7,72.31 U$8.1 | 49.82,42.23 49.81,42.22 | 49.82,42.23 49.84,42.22 IC1.11
N$78
  Top 0.152: IC1.12 49.85,43.55 50.3,43.55 51.07,44.31 51.07,44.62 51.13,44.65 51.13,45.19 54.79,48.84 54.79,49.91 61.11,56.24 104.7,56.24 105.77,57.3 105.77,67.13 102.79,70.1 95.48,70.1 93.27,72.31 U$7.1
N$79  (via drill 0.35)
  Top 0.152: 50.23,44.77 IC1.13 50.29,44.81 54.48,49 54.48,50.06 61.27,56.84 v68.5,56.84 | v81.69,70.03 81.69,72.24 81.76,72.31 U$6.1
  Bottom 0.152: v81.69,70.03 v68.5,56.84
N$80  (via drill 0.35)
  Top 0.152: 50.3,47.36 49.85,47.36 IC1.15 50.37,47.4 51.97,49 v51.97,56.84 | v57.91,70.03 57.91,70.41 58.9,71.4 58.9,72.31 U$4.1
  Bottom 0.152: v51.97,56.84 51.97,64.08 v57.91,70.03
N$81
  Top 0.152: S5.3 40.96,16.19 49.53,16.19 49.53,21.64 48.22,22.95 47.49,22.95 U2.77
N$82
  Top 0.152: S5.1 45.73,15.89 49.66,15.89 49.84,16.07 49.84,21.83 48.22,23.45 47.49,23.45 U2.78
N$84
  Top 0.152: U2.59 37.25,20.45 37.25,18.46 33.39,14.61 28.89,14.61 28.89,7.94 S4.1
N$85  (via drill 0.35)
  Top 0.152: 36.75,20.45 U2.58 36.87,18.51 33.63,15.27 32.1,15.27 v32.07,15.24 | S3.3 82.96,10.79 81.91,9.74 79.38,9.74 75.77,13.35 55.64,13.35 53.75,15.24 v53.34,15.24
  Bottom 0.152: v32.07,15.24 v53.34,15.24
N$86  (via drill 0.35)
  Top 0.152: 36.25,20.45 U2.57 36.37,18.59 33.97,16.19 v32.7,16.19 | v52.39,15.88 52.73,15.53 52.73,14.99 54.68,13.05 71.41,13.05 71.69,12.76 73.6,12.76 79.27,7.09 82.22,7.09 83.59,5.71 S3.1
  Bottom 0.152: v32.7,16.19 52.07,16.19 v52.39,15.88
N$87  (via drill 0.35)
  Top 0.152: 35.75,20.45 U2.56 35.87,18.73 33.97,16.83 v31.75,16.83 | S2.3 78.85,10.79 75.33,14.32 55.63,14.32 53.75,16.19 v53.66,16.19
  Bottom 0.152: v31.75,16.83 31.78,16.8 52.32,16.8 52.93,16.19 v53.66,16.19
N$89  (via drill 0.35)
  Top 0.152: U2.54 34.87,19 33.97,18.1 v31.75,18.1 | v52.07,17.78 51.71,17.78 51.41,17.48 51.41,14.97 54.22,12.15 63.62,12.15 64.98,10.79 S1.3
  Bottom 0.152: v31.75,18.1 51.75,18.1 v52.07,17.78
N$90  (via drill 0.35)
  Top 0.152: U2.53 34.37,19.13 33.97,18.73 v32.7,18.73 | v50.8,18.73 50.8,18.64 50.19,18.03 50.19,15.94 50.8,15.33 50.8,12.38 51.33,11.85 63.49,11.85 69.62,5.71 S1.1
  Bottom 0.152: v32.7,18.73 v50.8,18.73
PWR
  Top 2.54: U$1.6 21.27,64.45 | 46.35,64.77 46.35,64.74 45.8,64.74 45.8,63.89 U$3.6 | 91.44,64.74 91.44,63.81 U$7.6 | 91.12,64.45 91.12,63.49 U$7.6 | 32.67,64.77 U$2.6 | H6.B5 8.89,49.53 C17.+ 17.78,50.44 17.78,62.23 18.41,62.87 18.73,62.55 21.26,62.55 21.26,62.26 U$1.6 | 43.81,62.55 U$3.6 | U$3.6 U$4.6 U$5.6 U$6.6 U$7.6 | U$7.6 | U$7.6 90.48,62.22 90.81,62.55 88.9,62.55 88.58,62.23 101.35,62.23 | 101.35,62.23 101.6,62.23 101.92,62.55 | U$1.6 22.48,64.39 31.47,64.39 U$2.6 | 101.35,62.23 101.35,62.26 U$8.6 | U$7.6 89.84,62.26 U$7.6 | U$2.6 U$3.6